# Altium schematic sheet Kinen Port.SchDoc
size A
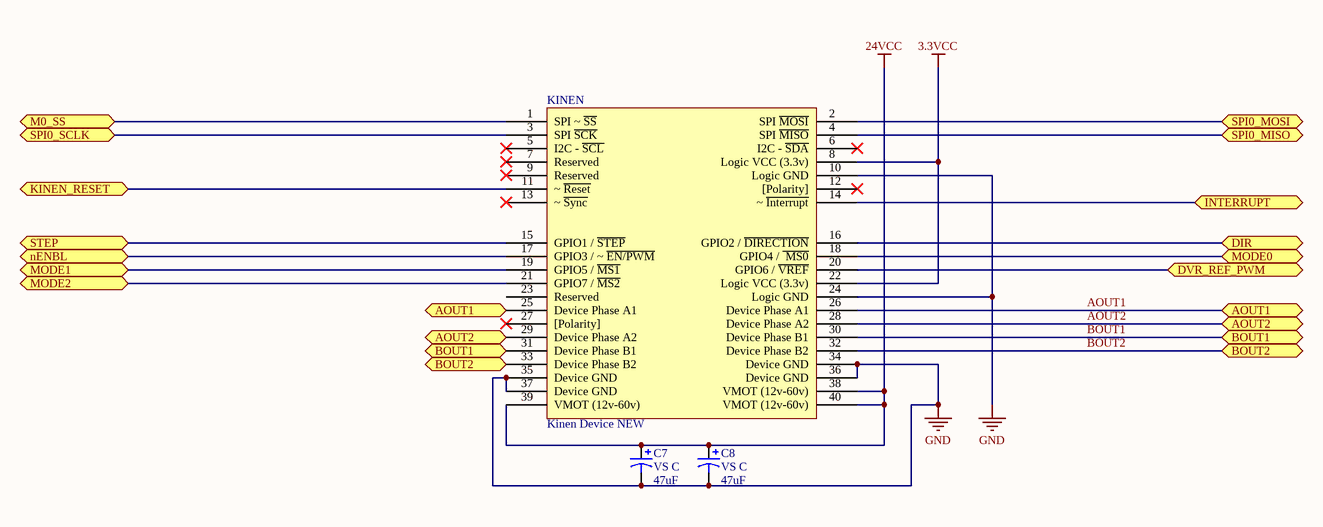
[diagram p0: Kinen Port.SchDoc]

## Parts
C7  VS C  value 47uF  [Panasonic VS C]
C8  VS C  value 47uF  [Panasonic VS C]
KINEN  Kinen Device NEW  [Kinen Port - Device]

## Ports
AOUT1, AOUT2, BOUT1, BOUT2, DIR, DVR_REF_PWM, INTERRUPT, KINEN_RESET, M0_SS, MODE0, MODE1, MODE2, nENBL, SPI0_MISO, SPI0_MOSI, SPI0_SCLK, STEP

## Nets
3.3VCC: KINEN.8(Logic_VCC_(3.3v)) KINEN.22(Logic_VCC_(3.3v))
24VCC: C7.1 C8.1 KINEN.38(VMOT_(12v-60v)) KINEN.39(VMOT_(12v-60v)) KINEN.40(VMOT_(12v-60v))
GND: C7.2 C8.2 KINEN.10(Logic_GND) KINEN.24(Logic_GND) KINEN.34(Device_GND) KINEN.35(Device_GND) KINEN.36(Device_GND) KINEN.37(Device_GND)
AOUT1: KINEN.25(Device_Phase_A1) KINEN.26(Device_Phase_A1) ; port AOUT1
AOUT2: KINEN.28(Device_Phase_A2) KINEN.29(Device_Phase_A2) ; port AOUT2
BOUT1: KINEN.30(Device_Phase_B1) KINEN.31(Device_Phase_B1) ; port BOUT1
BOUT2: KINEN.32(Device_Phase_B2) KINEN.33(Device_Phase_B2) ; port BOUT2
DIR: KINEN.16(GPIO2_/_~{DIRECTION}) ; port DIR
DVR_REF_PWM: KINEN.20(GPIO6_/_~{VREF}) ; port DVR_REF_PWM
INTERRUPT: KINEN.14(~_~{Interrupt}) ; port INTERRUPT
KINEN_RESET: KINEN.11(~_~{Reset}) ; port KINEN_RESET
M0_SS: KINEN.1(SPI_~_~{SS}) ; port M0_SS
MODE0: KINEN.18(GPIO4_/_~{_MS0}) ; port MODE0
MODE1: KINEN.19(GPIO5_/_~{MS1}) ; port MODE1
MODE2: KINEN.21(GPIO7_/_~{MS2}) ; port MODE2
nENBL: KINEN.17(GPIO3_/_~_~{EN/PWM}) ; port nENBL
SPI0_MISO: KINEN.4(SPI_~{MISO}) ; port SPI0_MISO
SPI0_MOSI: KINEN.2(SPI_~{MOSI}) ; port SPI0_MOSI
SPI0_SCLK: KINEN.3(SPI_~{SCK}) ; port SPI0_SCLK
STEP: KINEN.15(GPIO1_/_~{STEP}) ; port STEP

Not connected (* = marked no-connect by the designer): KINEN 5(I2C_-_~{SCL})* 6(I2C_-_~{SDA})* 7(Reserved)* 9(Reserved)* 12([Polarity])* 13(~_~{Sync})* 23(Reserved) 27([Polarity])*

## Library data of the parts
C7 C8 = Cap Pol1: Polarized Capacitor (Radial); Published: 8-Jun-2000; LatestRevisionDate: 17-Jul-2002; LatestRevisionNote: Re-released for DXP Platform.; PackageReference: RB7.6-15; Publisher: Altium Limited; PackageDescription: Polarized Capacitor (Radial); 2 Leads